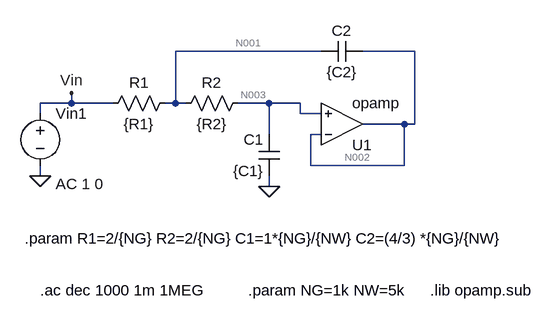
[diagram p0: schematic Draft2.asc]
Draft2.asc, the LTspice schematic file:
Version 4
SHEET 1 984 680
WIRE -64 32 -288 32
WIRE 80 32 0 32
WIRE -448 112 -448 96
WIRE -448 112 -496 112
WIRE -384 112 -448 112
WIRE -288 112 -288 32
WIRE -288 112 -304 112
WIRE -272 112 -288 112
WIRE -144 112 -192 112
WIRE -96 112 -144 112
WIRE -496 128 -496 112
WIRE -96 128 -96 112
WIRE -64 128 -96 128
WIRE 64 144 0 144
WIRE 80 144 80 32
WIRE 80 144 64 144
WIRE -144 160 -144 112
WIRE -64 160 -80 160
WIRE -80 208 -80 160
WIRE 64 208 64 144
WIRE 64 208 -80 208
WIRE -496 224 -496 208
WIRE -144 240 -144 224
FLAG -496 224 0
FLAG -448 96 Vin
FLAG -144 240 0
SYMBOL OpAmps\\opamp -32 208 M180
SYMATTR InstName U1
SYMBOL res -288 96 R90
WINDOW 0 0 56 VBottom 2
WINDOW 3 32 56 VTop 2
SYMATTR InstName R1
SYMATTR Value {R1}
SYMBOL res -176 96 R90
WINDOW 0 0 56 VBottom 2
WINDOW 3 32 56 VTop 2
SYMATTR InstName R2
SYMATTR Value {R2}
SYMBOL cap -128 224 R180
WINDOW 0 24 56 Left 2
WINDOW 3 24 8 Left 2
SYMATTR InstName C1
SYMATTR Value {C1}
SYMBOL voltage -496 112 R0
WINDOW 123 24 124 Left 2
WINDOW 39 0 0 Left 0
SYMATTR Value2 AC 1 0
SYMATTR InstName Vin1
SYMATTR Value ""
SYMBOL cap -64 48 R270
WINDOW 0 32 32 VTop 2
WINDOW 3 0 32 VBottom 2
SYMATTR InstName C2
SYMATTR Value {C2}
TEXT 104 400 Left 2 !.lib opamp.sub
TEXT -520 320 Left 2 !.param R1=2/{NG} R2=2/{NG} C1=1*{NG}/{NW} C2=(4/3) *{NG}/{NW}
TEXT -496 400 Left 2 !.ac dec 1000 1m 1MEG
TEXT -176 400 Left 2 !.param NG=1k NW=5k

The netlist it stands for:
* Draft2.asc
XU1 N002 N003 N002 opamp Aol=100K GBW=10Meg  ; pins invin noninvin out
R1 N001 Vin {R1}
R2 N003 N001 {R2}
C1 0 N003 {C1}
Vin1 Vin 0 AC 1 0
C2 N001 N002 {C2}
.lib opamp.sub
.param R1=2/{NG} R2=2/{NG} C1=1*{NG}/{NW} C2=(4/3) *{NG}/{NW}
.ac dec 1000 1m 1MEG
.param NG=1k NW=5k
.backanno
.end

* Results of the author's LTspice run, read from the files saved beside the schematic
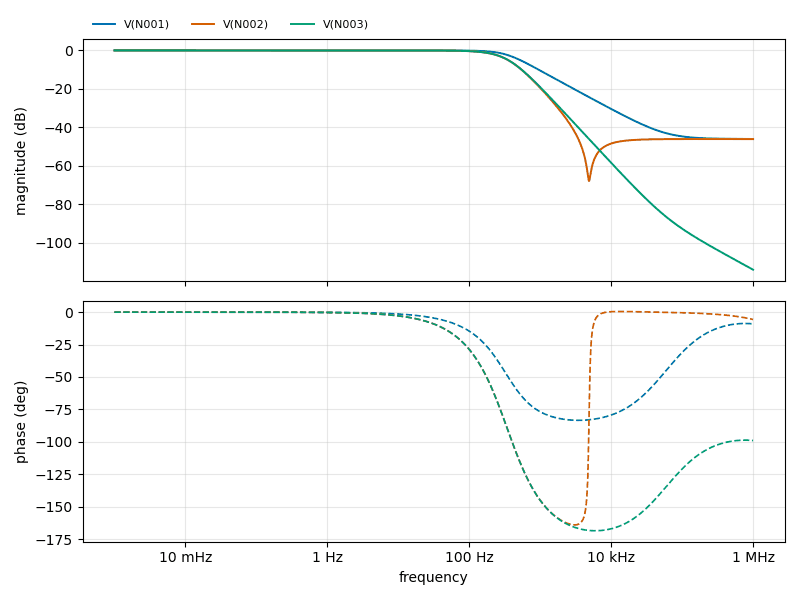
[diagram p1: AC Analysis of Draft2.asc, plotted from the saved traces]
* AC Analysis, 1 run:
*   V(N001): -0.00 dB at 1 mHz, -46.08 dB at 1 MHz, peak -0.00 dB at 1 mHz, 3 dB below the peak at 387.6 Hz
*   V(N002): -0.00 dB at 1 mHz, -46.15 dB at 1 MHz, peak -0.00 dB at 1 mHz, 3 dB below the peak at 269 Hz
*   V(N003): -0.00 dB at 1 mHz, -114.09 dB at 1 MHz, peak -0.00 dB at 1 mHz, 3 dB below the peak at 270.1 Hz